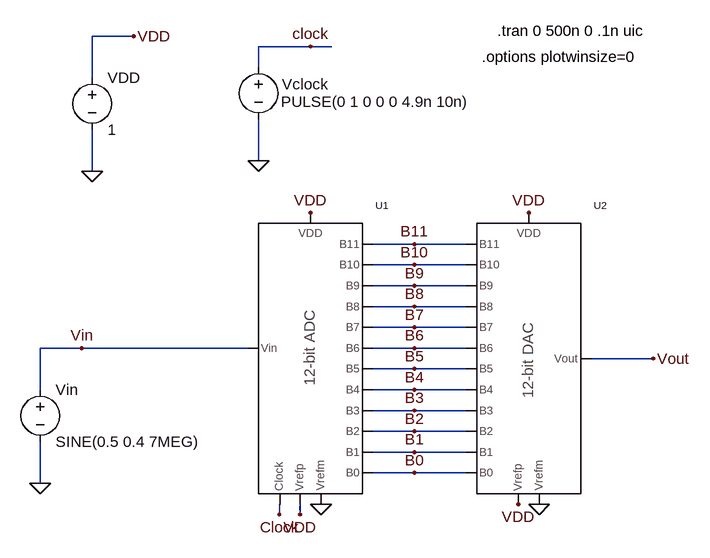
[diagram p0: schematic _Fig5_5_MSD_12_bit.asc]
_Fig5_5_MSD_12_bit.asc, the LTspice schematic file:
Version 4
SHEET 1 2740 696
WIRE 592 -816 528 -816
WIRE 864 -800 784 -800
WIRE 896 -800 864 -800
WIRE 784 -768 784 -800
WIRE 528 -752 528 -816
WIRE 784 -624 784 -688
WIRE 528 -608 528 -672
WIRE 1024 -496 960 -496
WIRE 1104 -496 1024 -496
WIRE 1024 -464 960 -464
WIRE 1104 -464 1024 -464
WIRE 1024 -432 960 -432
WIRE 1104 -432 1024 -432
WIRE 1024 -400 960 -400
WIRE 1104 -400 1024 -400
WIRE 1024 -368 960 -368
WIRE 1104 -368 1024 -368
WIRE 512 -336 448 -336
WIRE 768 -336 512 -336
WIRE 1024 -336 960 -336
WIRE 1104 -336 1024 -336
WIRE 1392 -320 1296 -320
WIRE 1024 -304 960 -304
WIRE 1104 -304 1024 -304
WIRE 448 -272 448 -336
WIRE 1024 -272 960 -272
WIRE 1104 -272 1024 -272
WIRE 1024 -240 960 -240
WIRE 1104 -240 1024 -240
WIRE 1024 -208 960 -208
WIRE 1104 -208 1024 -208
WIRE 1024 -176 960 -176
WIRE 1104 -176 1024 -176
WIRE 1024 -144 960 -144
WIRE 1104 -144 1024 -144
WIRE 448 -128 448 -192
WIRE 816 -80 816 -96
WIRE 848 -80 848 -96
FLAG 448 -128 0
FLAG 512 -336 Vin
FLAG 784 -624 0
FLAG 864 -800 clock
FLAG 528 -608 0
FLAG 592 -816 VDD
FLAG 1392 -320 Vout
FLAG 1184 -96 VDD
FLAG 1216 -96 0
FLAG 1024 -368 B7
FLAG 1024 -336 B6
FLAG 1024 -304 B5
FLAG 1024 -272 B4
FLAG 1024 -240 B3
FLAG 1024 -208 B2
FLAG 1024 -176 B1
FLAG 1024 -144 B0
FLAG 1200 -544 VDD
FLAG 864 -544 VDD
FLAG 880 -96 0
FLAG 816 -80 Clock
FLAG 848 -80 VDD
FLAG 1024 -400 B8
FLAG 1024 -432 B9
FLAG 1024 -464 B10
FLAG 1024 -496 B11
SYMBOL voltage 448 -288 R0
WINDOW 123 0 0 Left 0
WINDOW 39 0 0 Left 0
SYMATTR InstName Vin
SYMATTR Value SINE(0.5 0.4 7MEG)
SYMBOL voltage 784 -784 R0
WINDOW 0 36 42 Left 0
WINDOW 3 35 69 Left 0
WINDOW 123 0 0 Left 0
WINDOW 39 0 0 Left 0
SYMATTR InstName Vclock
SYMATTR Value PULSE(0 1 0 0 0 4.9n 10n)
SYMBOL voltage 528 -768 R0
WINDOW 123 0 0 Left 0
WINDOW 39 0 0 Left 0
SYMATTR InstName VDD
SYMATTR Value 1
SYMBOL Ideal_12_bit_DAC 1120 -112 R0
SYMATTR InstName U2
SYMBOL Ideal_12_bit_ADC 784 -112 R0
SYMATTR InstName U1
TEXT 1152 -824 Left 0 !.tran 0 500n 0 .1n uic
TEXT 1128 -784 Left 0 !.options plotwinsize=0

The netlist it stands for:
* _Fig5_5_MSD_12_bit.asc
Vin Vin 0 SINE(0.5 0.4 7MEG)
Vclock clock 0 PULSE(0 1 0 0 0 4.9n 10n)
VDD VDD 0 1
XU2 B11 B10 B9 B8 B7 B6 B5 B4 B3 B2 B1 B0 Vout VDD 0 VDD Ideal_12_bit_DAC  ; pins B11 B10 B9 B8 B7 B6 B5 B4 B3 B2 B1 B0 Vout Vrefp Vrefm VDD
XU1 B11 B10 B9 B8 B7 B6 B5 B4 B3 B2 B1 B0 Vin VDD 0 clock VDD Ideal_12_bit_ADC  ; pins B11 B10 B9 B8 B7 B6 B5 B4 B3 B2 B1 B0 Vin Vrefp Vrefm Clock VDD
.tran 0 500n 0 .1n uic
.options plotwinsize=0
.backanno
.end